# Altium project CameraCageBB.PrjPcb
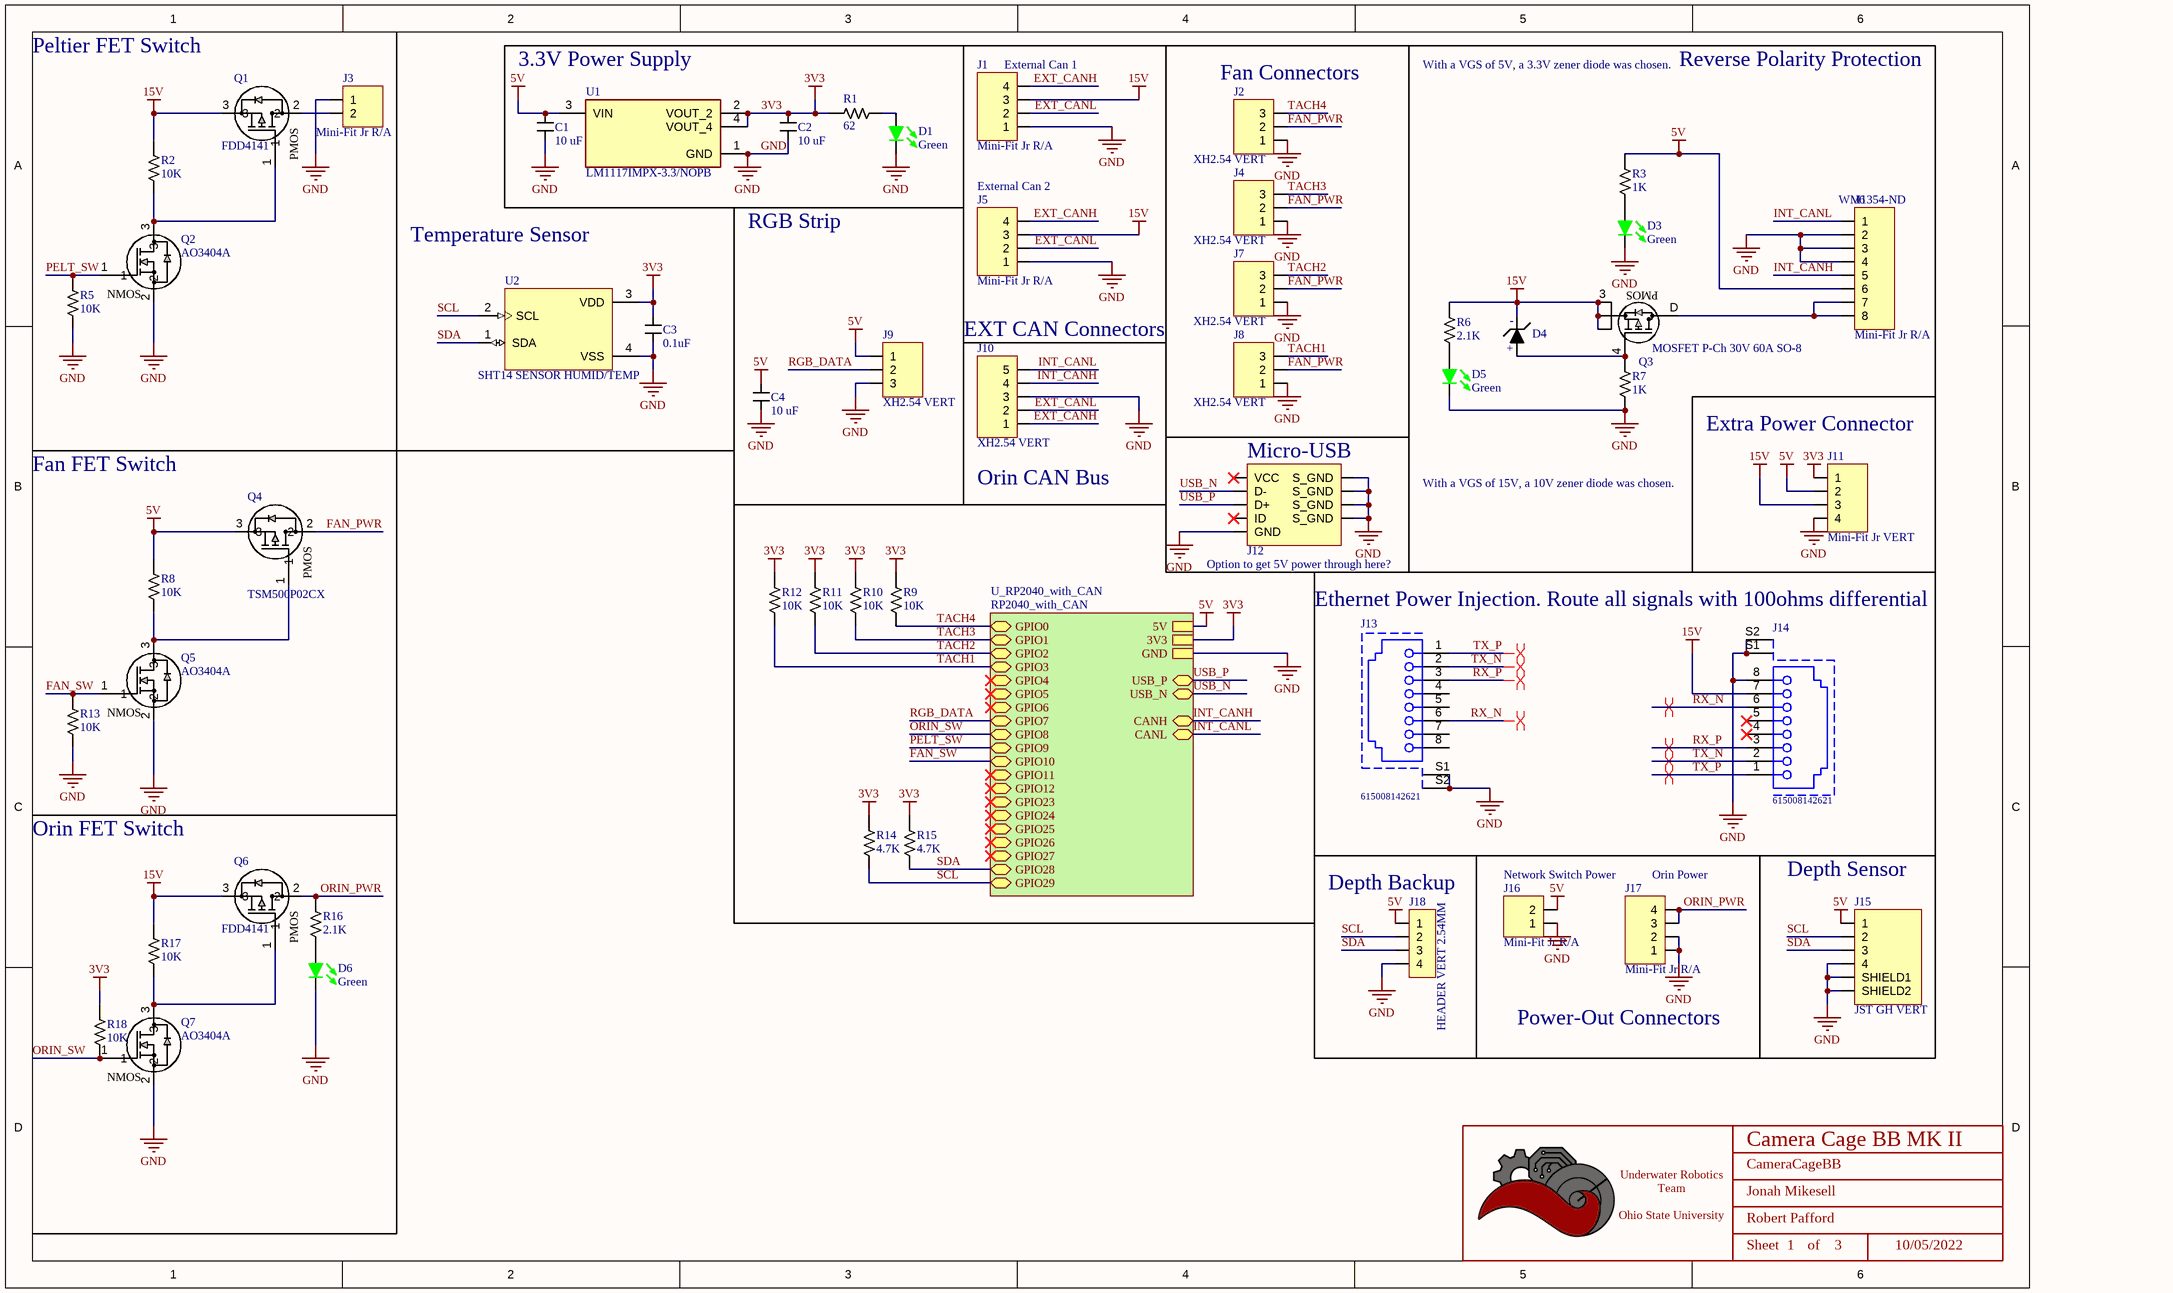
[diagram p0: CameraCageBB.SchDoc]
TeamLead: Robert Pafford; ProjectTitle: Camera Cage BB MK II; DateOfDesignReview: 1/10/2023; BoardRevision: 1.1
1 sheet, 54 parts. Net scope: hierarchical (ports join the sheet entries above them; power ports are global).
Board file: CameraCageBB.PcbDoc

## Sheet CameraCageBB.SchDoc: CameraCageBB
size B; Date: 10/05/2022; Author: Jonah Mikesell; Organization: ORGANIZATION; Address1: ADDRESS 1; Address2: ADDRESS 2; Address3: ADDRESS 3; Address4: ADDRESS 4; Revision: 0; SheetNumber: 1; SheetTotal: 3; ENG_APP_DATE: --/--/--; DSN_APP_DATE: --/--/--; CHK_APP_DATE: --/--/--

### Parts
*  Title_Block  [LOGO]  (value not drawn)  (graphical)
C1  Value (uF): 10 uF  [CAPACITOR_0603]  (hidden comment: 10uF Ceramic 6.3V)
C2  Value (uF): 10 uF  [CAPACITOR_0603]  (hidden comment: 10uF Ceramic 6.3V)
C3  value 0.1uF  [CAPACITOR_0603]  (hidden comment: 100nF Ceramic 6.3V)
C4  Value (uF): 10 uF  [CAPACITOR_0603]  (hidden comment: 10uF Ceramic 6.3V)
D1  Color: Green  [LED_0603]  (hidden comment: IN-S63AT5G)
D3  Color: Green  [LED_0603]  (hidden comment: IN-S63AT5G)
D4  Zener_Diode_10V_410mW  [SOD-123]  (value not drawn)
D5  Color: Green  [LED_0603]  (hidden comment: IN-S63AT5G)
D6  Color: Green  [LED_0603]  (hidden comment: IN-S63AT5G)
J1  Mini-Fit Jr R/A  [CONN_MOLEX_MINIFIT JR_4 POS_R/A]
J2  XH2.54 VERT  [CONN_JST_XH254_3POS_VERT]
J3  Mini-Fit Jr R/A  [CONN_MOLEX_MINIFIT JR_2 POS_R/A]
J4  XH2.54 VERT  [CONN_JST_XH254_3POS_VERT]
J5  Mini-Fit Jr R/A  [CONN_MOLEX_MINIFIT JR_4 POS_R/A]
J6  Mini-Fit Jr R/A  Supplier Part Number 1: WM1354-ND  [CONN_MOLEX_MINIFIT JR_8 POS_R/A]
J7  XH2.54 VERT  [CONN_JST_XH254_3POS_VERT]
J8  XH2.54 VERT  [CONN_JST_XH254_3POS_VERT]
J9  XH2.54 VERT  [CONN_JST_XH254_3POS_VERT]
J10  XH2.54 VERT  [CONN_JST_XH254_5POS_VERT]
J11  Mini-Fit Jr VERT  [CONN_MOLEX_MINIFIT JR_4 POS_VERT]
J12  USB_MICRO R/A  [CONN_MINIUSB]  (value not drawn)
J13  615008142621  [615008142621]
J14  615008142621  [615008142621]
J15  JST GH VERT  [CONN_JST_BM04B-GHS-TBT(LF)(SN)(N)]
J16  Mini-Fit Jr R/A  [CONN_MOLEX_MINIFIT JR_2 POS_R/A]
J17  Mini-Fit Jr R/A  [CONN_MOLEX_MINIFIT JR_4 POS_R/A]
J18  HEADER VERT 2.54MM  [HEADER_4PIN_2.54MM]
Q1  FDD4141  [DPAK_ONS]
Q2  AO3404A  [SOT-23-3]
Q3  MOSFET P-Ch 30V 60A SO-8  [MOSFET_7DP-T1-GE3_VIS]
Q4  TSM500P02CX  [SOT-23-3]
Q5  AO3404A  [SOT-23-3]
Q6  FDD4141  [DPAK_ONS]
Q7  AO3404A  [SOT-23-3]
R1  Value  (Ohms): 62  [RESISTOR_0603]  (hidden comment: 62 Ohm 1% 1/4W)
R2  Value  (Ohms): 10K  [RESISTOR_0603]  (hidden comment: 10k Ohm 5% 1/10W)
R3  Value  (Ohms): 1K  [RESISTOR_0603]  (hidden comment: 1k Ohm 5% 1/8W)
R5  Value  (Ohms): 10K  [RESISTOR_0603]  (hidden comment: 10k Ohm 5% 1/10W)
R6  Value  (Ohms): 2.1K  [RESISTOR_0603]  (hidden comment: 2.1k Ohm 5% 1/8W)
R7  Value  (Ohms): 1K  [RESISTOR_0603]  (hidden comment: 1k Ohm 5% 1/8W)
R8  Value  (Ohms): 10K  [RESISTOR_0603]  (hidden comment: 10k Ohm 5% 1/10W)
R9  Value  (Ohms): 10K  [RESISTOR_0603]  (hidden comment: 10k Ohm 5% 1/10W)
R10  Value  (Ohms): 10K  [RESISTOR_0603]  (hidden comment: 10k Ohm 5% 1/10W)
R11  Value  (Ohms): 10K  [RESISTOR_0603]  (hidden comment: 10k Ohm 5% 1/10W)
R12  Value  (Ohms): 10K  [RESISTOR_0603]  (hidden comment: 10k Ohm 5% 1/10W)
R13  Value  (Ohms): 10K  [RESISTOR_0603]  (hidden comment: 10k Ohm 5% 1/10W)
R14  Value  (Ohms): 4.7K  [RESISTOR_0603]  (hidden comment: 4.7k Ohm 5% 1/10W)
R15  Value  (Ohms): 4.7K  [RESISTOR_0603]  (hidden comment: 4.7k Ohm 5% 1/10W)
R16  Value  (Ohms): 2.1K  [RESISTOR_0603]  (hidden comment: 2.1k Ohm 5% 1/8W)
R17  Value  (Ohms): 10K  [RESISTOR_0603]  (hidden comment: 10k Ohm 5% 1/10W)
R18  Value  (Ohms): 10K  [RESISTOR_0603]  (hidden comment: 10k Ohm 5% 1/10W)
U1  LM1117IMPX-3.3/NOPB  [SOT-223-4]
U2  SHT14 SENSOR HUMID/TEMP  [XDCR_SHT41-AD1B-R2]

### Sub-sheets
U_RP2040_with_CAN = RP2040_with_CAN (file not in this document): USB_P (bidir), USB_N (bidir), 5V, CANH (bidir), CANL (bidir), GPIO0 (bidir), GPIO1 (bidir), GPIO2 (bidir), GPIO3 (bidir), GPIO4 (bidir), GPIO5 (bidir), GPIO6 (bidir), GPIO7 (bidir), GPIO8 (bidir), GPIO9 (bidir), GPIO10 (bidir), GPIO11 (bidir), GPIO12 (bidir), GPIO23 (bidir), GPIO24 (bidir), GPIO25 (bidir), GPIO26 (bidir), GPIO27 (bidir), GPIO28 (bidir), GPIO29 (bidir), 3V3, GND

### Nets
3V3: C2.1 C3.1 J11.1 R1.1 R9.1 R10.1 R11.1 R12.1 R14.1 R15.1 R18.1 U1.2(VOUT_2) U1.4(VOUT_4) U2.3(VDD) ; sheet U_RP2040_with_CAN/3V3
5V: C1.1 C4.1 J6.6 J9.1 J11.2 J15.1 J16.2 J18.1 Q4.3 R3.1 R8.1 U1.3(VIN) ; sheet U_RP2040_with_CAN/5V
15V: D4.2 J1.3 J5.3 J11.3 J14.7 Q1.3 Q3.1(S) Q3.2(S) Q3.3(S) Q6.3 R2.1 R6.1 R17.1
GND: C1.2 C2.2 C3.2 C4.2 D1.2 D3.2 D5.2 D6.2 J1.1 J2.1 J3.1 J4.1 J5.1 J6.2 J6.3 J6.4 J7.1 J8.1 J9.3 J10.3 J11.4 J12.5(GND) J12.6(S_GND) J12.7(S_GND) J12.8(S_GND) J12.9(S_GND) J13.S1 J13.S2 J14.8 J14.S1 J14.S2 J15.4 J15.S1(SHIELD1) J15.S2(SHIELD2) J16.1 J17.1 J17.2 J18.4 Q2.2 Q5.2 Q7.2 R5.2 R7.2 R13.2 U1.1(GND) U2.4(VSS) ; sheet U_RP2040_with_CAN/GND
EXT_CANH: J1.4 J5.4 J10.1
EXT_CANL: J1.2 J5.2 J10.2
FAN_PWR: J2.2 J4.2 J7.2 J8.2 Q4.2
FAN_SW: Q5.1 R13.1 ; sheet U_RP2040_with_CAN/GPIO10
INT_CANH: J6.5 J10.4 ; sheet U_RP2040_with_CAN/CANH
INT_CANL: J6.1 J10.5 ; sheet U_RP2040_with_CAN/CANL
ORIN_PWR: J17.3 J17.4 Q6.2 R16.1
ORIN_SW: Q7.1 R18.2 ; sheet U_RP2040_with_CAN/GPIO8
PELT_SW: Q2.1 R5.1 ; sheet U_RP2040_with_CAN/GPIO9
RGB_DATA: J9.2 ; sheet U_RP2040_with_CAN/GPIO7
RX_N: J13.6 J14.6
RX_P: J13.3 J14.3
SCL: J15.2 J18.2 R14.2 U2.2(SCL) ; sheet U_RP2040_with_CAN/GPIO29
SDA: J15.3 J18.3 R15.2 U2.1(SDA) ; sheet U_RP2040_with_CAN/GPIO28
TACH1: J8.3 R12.2 ; sheet U_RP2040_with_CAN/GPIO3
TACH2: J7.3 R11.2 ; sheet U_RP2040_with_CAN/GPIO2
TACH3: J4.3 R10.2 ; sheet U_RP2040_with_CAN/GPIO1
TACH4: J2.3 R9.2 ; sheet U_RP2040_with_CAN/GPIO0
TX_N: J13.2 J14.2
TX_P: J13.1 J14.1
USB_N: J12.2(D-) ; sheet U_RP2040_with_CAN/USB_N
USB_P: J12.3(D+) ; sheet U_RP2040_with_CAN/USB_P
NetD1_1: D1.1 R1.2
NetD3_1: D3.1 R3.2
NetD4_1: D4.1 Q3.4(G) R7.1
NetD5_1: D5.1 R6.2
NetD6_1: D6.1 R16.2
NetJ3_2: J3.2 Q1.2
NetJ6_7: J6.7 J6.8 Q3.D
NetQ1_1: Q1.1 Q2.3 R2.2
NetQ4_1: Q4.1 Q5.3 R8.2
NetQ6_1: Q6.1 Q7.3 R17.2

Not connected (* = marked no-connect by the designer): J12 1(VCC)* 4(ID)*; J13 4 5 7 8; J14 4* 5*

### Layout directives
differential pair; differential pair class Ethernet: RX_N, RX_P, TX_N, TX_P

### Notes on the sheet
- Peltier FET Switch
- 3.3V Power Supply
- (near J1) External Can 1
- (near J2) Fan Connectors
- With a VGS of 5V, a 3.3V zener diode was chosen.
- Reverse Polarity Protection
- RGB Strip
- (near J5) External Can 2
- Temperature Sensor
- (near J10) EXT CAN Connectors
- (near J11) Extra Power Connector
- Fan FET Switch
- (near J10) Orin CAN Bus
- (near J12) Micro-USB
- With a VGS of 15V, a 10V zener diode was chosen.
- (near J12) Option to get 5V power through here?
- Ethernet Power Injection. Route all signals with 100ohms differential
- Orin FET Switch
- (near J18) Depth Backup
- (near J16) Network Switch Power
- (near J17) Orin Power
- (near J15) Depth Sensor
- Power-Out Connectors
- DWG. NO.
- REV.
- SHT.
- THIS DOCUMENT AND THE DATA DISCLOSED HEREIN OR HEREWITH IS THE PROPERTY OF ALTIUM LIMITED AND MAY BE FREELY DISTRIBUTED IN WHOLE. NO RIGHTS ARE RESERVED OR EXPRESS OR IMPLIED WARANTEE GIVEN.
- REVISION
- DESCRIPTION
- DATE
- APPROVED
- ENG:
- APPROVALS
- PROJECT
- DSN:
- CHK:
- REFERENCE DOCUMENTS
- PROJECT REVISION:
- TITLE
- DOCUMENT REVISION:
- DESIGN ITEM:
- BOM:
- FAB DWG:
- PCB DWG:
- ASSY DWG:
- SCALE:
- SIZE
- B
- CAGE CODE
- FILE NAME
- DWG NO.
- SHEET
- OF
- REV
- (in symbol AO3404A) NMOS
- (in symbol FDD4141) PMOS
- (in symbol SIR167DP-T1-GE3) PMOS
- (in symbol Title_Block) Underwater Robotics Team / Ohio State University; Sheet; of
- (in symbol TSM500P02CX) PMOS
- (in symbol Zener_Diode_10V_410mW) -; +

### Library data of the parts
* = Title_Block: UWRT Schematic Title Block Template / Created June 2021, Dylan Trainor
C1 C2 C4 = CAPACITOR_10uF_0603: Cap 10uF 6.3V +/-20% / Ceramic 0603; Made By: Flip B; ComponentLink1Description: Digikey; ComponentLink1URL: https://www.digikey.com/en/products/detail/samsung-electro-mechanics/CL10A106MQ8NNNC/3886777; Supplier 1: Digi-Key; Supplier Part Number 1: 1276-1119-1-ND; Tolerance: +/- 20%; Voltage: 6.3V
C3 = CAPACITOR_0.1uF_0603: Cap 100nF 6.3V +/-10% / Ceramic 0603; Made By: Flip B; ComponentLink1Description: Datsheet; ComponentLink1URL: https://www.mouser.com/datasheet/2/212/KEM_C1002_X7R_SMD-1102033.pdf; Tolerance: +/- 10%; Voltage: 6.3V; Supplier 1: Digi-Key; Supplier Part Number 1: 399-15351-1-ND
D1 D3 D5 D6 = LED_Green_0603_3V: LED Green Vf= 3V If = 0.005A / IN-S63AT5G; Made By: Robert Pafford; Forward Current: 5mA; ComponentLink1Description: Datasheet; ComponentLink1URL: https://www.we-online.de/katalog/datasheet/150060GS75000.pdf; Forward Voltage: 3V; Package: 0603; Supplier 1: Digi-Key; Supplier Part Number 1: 1830-1062-1-ND
D4 = Zener_Diode_10V_410mW: Zener Diode | 10 V | 410 mW | SOD 123; Made By: Nathan A; Voltage - Zener: 10V; Power: 410mW; Package: SOD-123; Supplier 1: Digi-Key; Supplier Part Number 1: 3757-BZT52-C10_R1_00001CT-ND; ComponentLink1Description: Datasheet; ComponentLink1URL: https://www.panjit.com.tw/upload/datasheet/BZT52-C2V4_SERIES.pdf
J1 J5 J17 = CONN_MOLEX_MINIFIT JR_4POS_R/A: Molex Minifit Jr. 5569 / 4 Pos R/A Natural; Pitch: 4.2mm; Configuration: Right Angle; Current Per Pin: 13A; Number of Positions: 4; Supplier Part Number 1: WM13112-ND; Supplier 1: Digi-Key; Manufacturer: Molex; Color: Natural; Created By: Flip B; ComponentLink1Description: Datasheet; ComponentLink1URL: https://www.molex.com/pdm_docs/sd/026013115_sd.pdf; Series: Minifit Jr 5569
J2 J4 J7-J9 = CONN_JST_XH254_3POS_VERT: JST XH 2.54mm Pitch 3 Pos Vertical; Current Per Pin: 4A; Number of Positions: 3; NOTE: Do not use JST 2.5mm parts with this footprint. JST does not make 2.54mm pitch pins, rather only clones make this connector!; Manufacturer: JST; Pitch: 2.54mm; Configuration: Vertical; Color: White; Created By: Robert P; Series: XH 2.54; ComponentLink1Description: Purchase Link; ComponentLink1URL: https://www.amazon.com/460PCS-XH2-54-Connector-Terminal-Connectors/dp/B09DBGVX5C
J3 J16 = CONN_MOLEX_MINIFIT JR_2POS_R/A: Molex Minifit Jr. 5569 / 2 Pos R/A Natural; Pitch: 4.2mm; Configuration: Right Angle; Current Per Pin: 13A; Number of Positions: 2; Manufacturer: Molex; Color: Natural; Created By: Robert P; ComponentLink1Description: Datasheet; ComponentLink1URL: https://www.molex.com/pdm_docs/sd/026013115_sd.pdf; Series: Minifit Jr 5569; Supplier 1: Digi-Key; Supplier Part Number 1: WM1351-ND
J6 = CONN_MOLEX_MINIFIT JR_8POS_R/A: Molex Minifit Jr. 5569 / 8 Pos R/A Natural; Pitch: 4.2mm; Configuration: Right Angle; Current Per Pin: 13A; Number of Positions: 8; Manufacturer: Molex; Color: Natural; Created By: Flip B; ComponentLink1Description: Datasheet; ComponentLink1URL: https://www.molex.com/pdm_docs/ps/PS-5556-001.pdf; Series: Minifit Jr 5569; Supplier 1: Digi-Key
J10 = CONN_JST_XH254_5POS_VERT: JST XH 2.54mm Pitch 5 Pos Vertical; Current Per Pin: 4A; Number of Positions: 5; NOTE: Do not use JST 2.5mm parts with this footprint. JST does not make 2.54mm pitch pins, rather only clones make this connector!; Manufacturer: JST; Pitch: 2.54mm; Configuration: Vertical; Color: White; Created By: Robert P; Series: XH 2.54; ComponentLink1Description: Purchase Link; ComponentLink1URL: https://www.amazon.com/460PCS-XH2-54-Connector-Terminal-Connectors/dp/B09DBGVX5C
J11 = CONN_MOLEX_MINIFIT JR_4POS_VERT: Molex Minifit Jr. 5566 / 4 Pos Vertical Natural; Pitch: 4.2mm; Current Per Pin: 13A; Number of Positions: 4; Manufacturer: Molex; Configuration: Vertical; Color: Natural; Created By: Robert P; Series: Minifit Jr 5566; Supplier 1: Digi-Key; Supplier Part Number 1: WM3801-ND
J12 = CONN_MICROUSB: Amphenol Micro USB-B / USB2.0 5 Pin Right Angle SMD; Pitch: 0.65mm; Current Per Pin: 1.8A; Number of Positions: 5; Manufacturer: Amphenol; Configuration: Right Angle; Color: Silver; Created By: Flip B; ComponentLink1Description: Datasheet; ComponentLink1URL: https://cdn.amphenol-icc.com/media/wysiwyg/files/documentation/datasheet/inputoutput/io_usb_micro.pdf?__cf_chl_jschl_tk__=05693735e19256298f6ef6ca2bb2e65c376a4f56-1625503833-0-Abitsb0-ufjOXJYs_S3J3r2iTn-nObalbmXUksF1VvO_h_WEmRdMlUD1I8-hmWSEVWzY1pirKnrPZWfgY3851qyBZe5ZvnNQePLGIzUgdEIQBVUyW36RsbYpDLEWxJ4horD-5gChFgobLYqwmG5aHl0E8lIn_twwPPrOxilK2gP0q9t_CNOs_u5fMqXvXUrlsOv8tIE2NRlu6NVP8qtkL2GjhlkeTUbDMF8WvvpPDTFOgvZ4Y16Ej8F8AhWos88mo5B1HssXozw0XrkJQIqERITUu6rqloz9kf4ZzhBHtDAt-IkiAFY_Ds9SW8FYKKTtINJVpHZQ6Gyu1FFM4Dc9MO0maE8_mmNcwlxqyRoRk_MPWW8VyByXWM5RSp52jteRKw7FeI9WIYvCbPAOy0Eyib-aseIQsnGbglBcUY6_2xp8GYaJM38H3dNvBPsSOfJBPndKedwKHllxjkucXn6xsN0sDXkpGN-cu8_2bDTJ0g-uUucKSCooYX-ApSDNGpkA_p9zv1SOAD8c0zaZVmtiBsN75QpVz2rzq9_BFxOywPvR; Series: 10118192; Supplier 1: Digi-Key; Supplier Part Number 1: 609-4613-1-ND
J13 J14 = CMP-1502-01702-1: Modular Jack WR-MJ, Tab Down, Shielded, with 3.05 mm Rear Grounding Post, Horizontal Entry, THT, 8P8C; Manufacturer: Wurth Elektronik; Withstanding Voltage: 1000VAC; Rated Current: 1.5A; Working Voltage: 120VAC; Compliance: Leadfree/RoHS; Port: 1x1; Contact Resistance: 20mOhm; Datasheet URL: https://katalog.we-online.de/em/datasheet/615008142621.pdf; Publisher: WurthElektronik; Entrance: Horizontal; Pin Number: 8P8C; Mounting Technology: THT; Manufacturer URL: http://www.we-online.de; Part Number: 615008142621; Package Reference: 615008142621; Packaging: Tray; Operating Temperature: -40to85degC
J15 = CONN_JST_GH_4POS_VERT: JST GH Pitch 4 Pos Vertical; Pitch: 1.25mm; Current Per Pin: 1A; Number of Positions: 4; Manufacturer: JST; Configuration: Vertical; Color: Natural; Created By: Robert P; Series: GH; Supplier 1: Digi-Key; Supplier Part Number 1: 455-1580-1-ND
J18 = HEADER_4PIN_2.54MM: CONN HEADER VERT 4POS 2.54MM; Made By: Robert Pafford; Supplier 1: Digi-Key; Supplier Part Number 1: S1012E-04-ND
Q1 Q6 = FDD4141: P-Channel 10.8A (Ta), 50A (Tc) 2.4W (Ta), 69W (Tc) Surface Mount D-PAK (TO-252AA); FET Type: P-Channel, Power; Vendor: ON Semiconductor; SourceLibrary: ON_Semiconductor_2020-01-13; Vgs (Max): ±20V; Vgs (th): 3V @ 250µA; Vdss: 40 V; Rds (on): 12.3mOhm @ 12.7A, 10V; Amp Rating: 10.8 A; Package: D-PAK (TO-252AA); Manufacturer_Part_Number: FDD4141; Power Dissipation: 2.4W (Ta), 69W (Tc); Supplier 1: Digi-Key; Supplier Part Number 1: FDD4141CT-ND; Created By: Dylan T
Q2 Q5 Q7 = AO3404A: N-Channel 30 V 5.8A (Ta) 1.4W (Ta) Surface Mount SOT-23-3; Vendor: Alpha & Omega Semiconductor Inc.; SourceLibrary: ON_Semiconductor_2020-01-13; Vgs (Max): 3V @ 5.8A, 10V; Vgs (th): 3V @ 250µA; Vdss: 30V; Rds (on): 28mOhm @ 5.8A, 10V; Amp Rating: 5.8 A; FET Type: N-Channel; Package: SOT23-3L; Manufacturer _Part_Number: AO3404A; Power Dissipation: 1.4W (Ta); Supplier 1: Digi-Key; Supplier Part Number 1: 785-1004-1-ND; Created By: Dylan T
Q3 = SIR167DP-T1-GE3: P-Channel 30 V 60A (Tc) 65.8W (Tc) Surface Mount PowerPAK® SO-8; Mfr_Name: Vishay; Type: DEV; Copyright: Copyright (C) 2022 Ultra Librarian. All rights reserved.; Manufacturer_Part_Number: SIR167DP-T1-GE3; RefDes: RefDes
Q4 = TSM500P02CX: P-Channel 20 V 4.7A (Tc) 1.56W (Tc) Surface Mount SOT-23; Vendor: Taiwan Semiconductor Corporation; Vgs (Max): ±10V; Vgs (th): 800mV @ 250µA; Vdss: 20 V; Rds (on): 50mOhm @ 3A, 4.5V; Amp Rating: 4.7 A; FET Type: P-Channel; Package: TO-236-3, SC-59, SOT-23-3; Manufacturer_Part_Number: TSM500P02CX; Power Dissipation: 1.56W (Tc); Created By: Robert Pafford; Supplier 1: Digi-Key; Supplier Part Number 1: TSM500P02CXRFGCT-ND
R1 = RESISTOR_62_0603: RES SMD 62 OHM 1% 1/4W 0603; Tolerance: +/- 1%; Made By: Robert Pafford; ComponentLink1Description: Datasheet; ComponentLink1URL: https://www.bourns.com/docs/product-datasheets/CRxxxxx.pdf; Wattage: 1/4W; Supplier: Digikey; Digikey Part Numer: CR0603-JW-104ELFTR-ND; Supplier 1: Digi-Key; Supplier Part Number 1: 541-RCS060362R0FKEACT-ND
R2 R5 R8-R13 R17 R18 = RESISTOR_10K_0603: RES 10k OHM 5% 1/10W 0603; Tolerance: +/- 5%; Wattage: 1/8W; Made By: Robert Pafford; ComponentLink1Description: Datasheet; ComponentLink1URL: https://www.bourns.com/docs/product-datasheets/CRxxxxx.pdf; Supplier: Digikey; Digikey Part Numer: CR0603-JW-104ELFTR-ND; Supplier 1: Digi-Key; Supplier Part Number 1: 2019-RK73B1JTTD103JCT-ND
R3 R7 = RESISTOR_1K_0603: RES 1k OHM 5% 1/8W 0603; Tolerance: +/- 5%; Made By: Robert Pafford; ComponentLink1Description: Datasheet; ComponentLink1URL: https://www.bourns.com/docs/product-datasheets/CRxxxxx.pdf; Wattage: 1/8W; Supplier: Digikey; Digikey Part Numer: CR0603-JW-104ELFTR-ND; Supplier 1: Digi-Key; Supplier Part Number 1: 2019-RK73B1JTTD102JCT-ND
R6 R16 = RESISTOR_2.1K_0603: RES 2.1k OHM 5% 1/8W 0603; Tolerance: +/- 5%; Made By: Robert Pafford; ComponentLink1Description: Datasheet; ComponentLink1URL: https://www.bourns.com/docs/product-datasheets/CRxxxxx.pdf; Wattage: 1/8W; Supplier: Digikey; Digikey Part Numer: CR0603-JW-104ELFTR-ND; Supplier 1: Digi-Key; Supplier Part Number 1: YAG1852CT-ND
R14 R15 = RESISTOR_4.7K_0603: RES 4.7k OHM 5% 1/10W 0603; Tolerance: +/- 5%; Made By: Robert Pafford; Wattage: 1/10W; Supplier: Digikey; Digikey Part Numer: CR0603-JW-104ELFTR-ND; Supplier 1: Digi-Key; Supplier Part Number 1: RMCF0603JT4K70CT-ND
U1 = LM1117IMPX-3.3/NOPB: 800-mA 15-V linear voltage regulator 4-SOT-223 -40 to 125; MF: Texas Instruments; Texas_Instruments-Purchase-URL: https://snapeda.com/shop?store=Texas+Instruments&id=410186; Price: None; Mouser-Purchase-URL: https://snapeda.com/shop?store=Mouser&id=410186; MP: LM1117IMPX-3.3/NOPB; Value: *; Availability: Good; Package: SOT-223-4 Texas Instruments; Arrow_Electronics-Purchase-URL: https://snapeda.com/shop?store=Arrow+Electronics&id=410186; SnapEDA_Link: https://www.snapeda.com/parts/LM1117IMPX-3.3/NOPB/Texas%20Instruments/view-part/410186/?ref=snap; DigiKey-Purchase-URL: https://snapeda.com/shop?store=DigiKey&id=410186
U2 = SHT41-AD1B-R2: Digital Relative Humidity Temperature Sensor, Â±1.8 / max 2.5 %RH, Â±0.2 Â°C, Ultra-Low-Power; MF: Sensirion; Price: None; SnapEDA_Link: https://www.snapeda.com/parts/SHT41-AD1B-R2/Sensirion/view-part/?ref=snap; MP: SHT41-AD1B-R2; Purchase-URL: https://pricing.snapeda.com/search/part/SHT41-AD1B-R2/?ref=eda; Value: *; Availability: In Stock; Package: None; Check_prices: https://www.snapeda.com/parts/SHT41-AD1B-R2/Sensirion/view-part/?ref=eda; Supplier 1: Digi-Key; Supplier Part Number 1: 1649-SHT41-AD1B-R2CT-ND